# Altium schematic sheet Gigabit Ethernet.SchDoc
size 594 x 420 mm
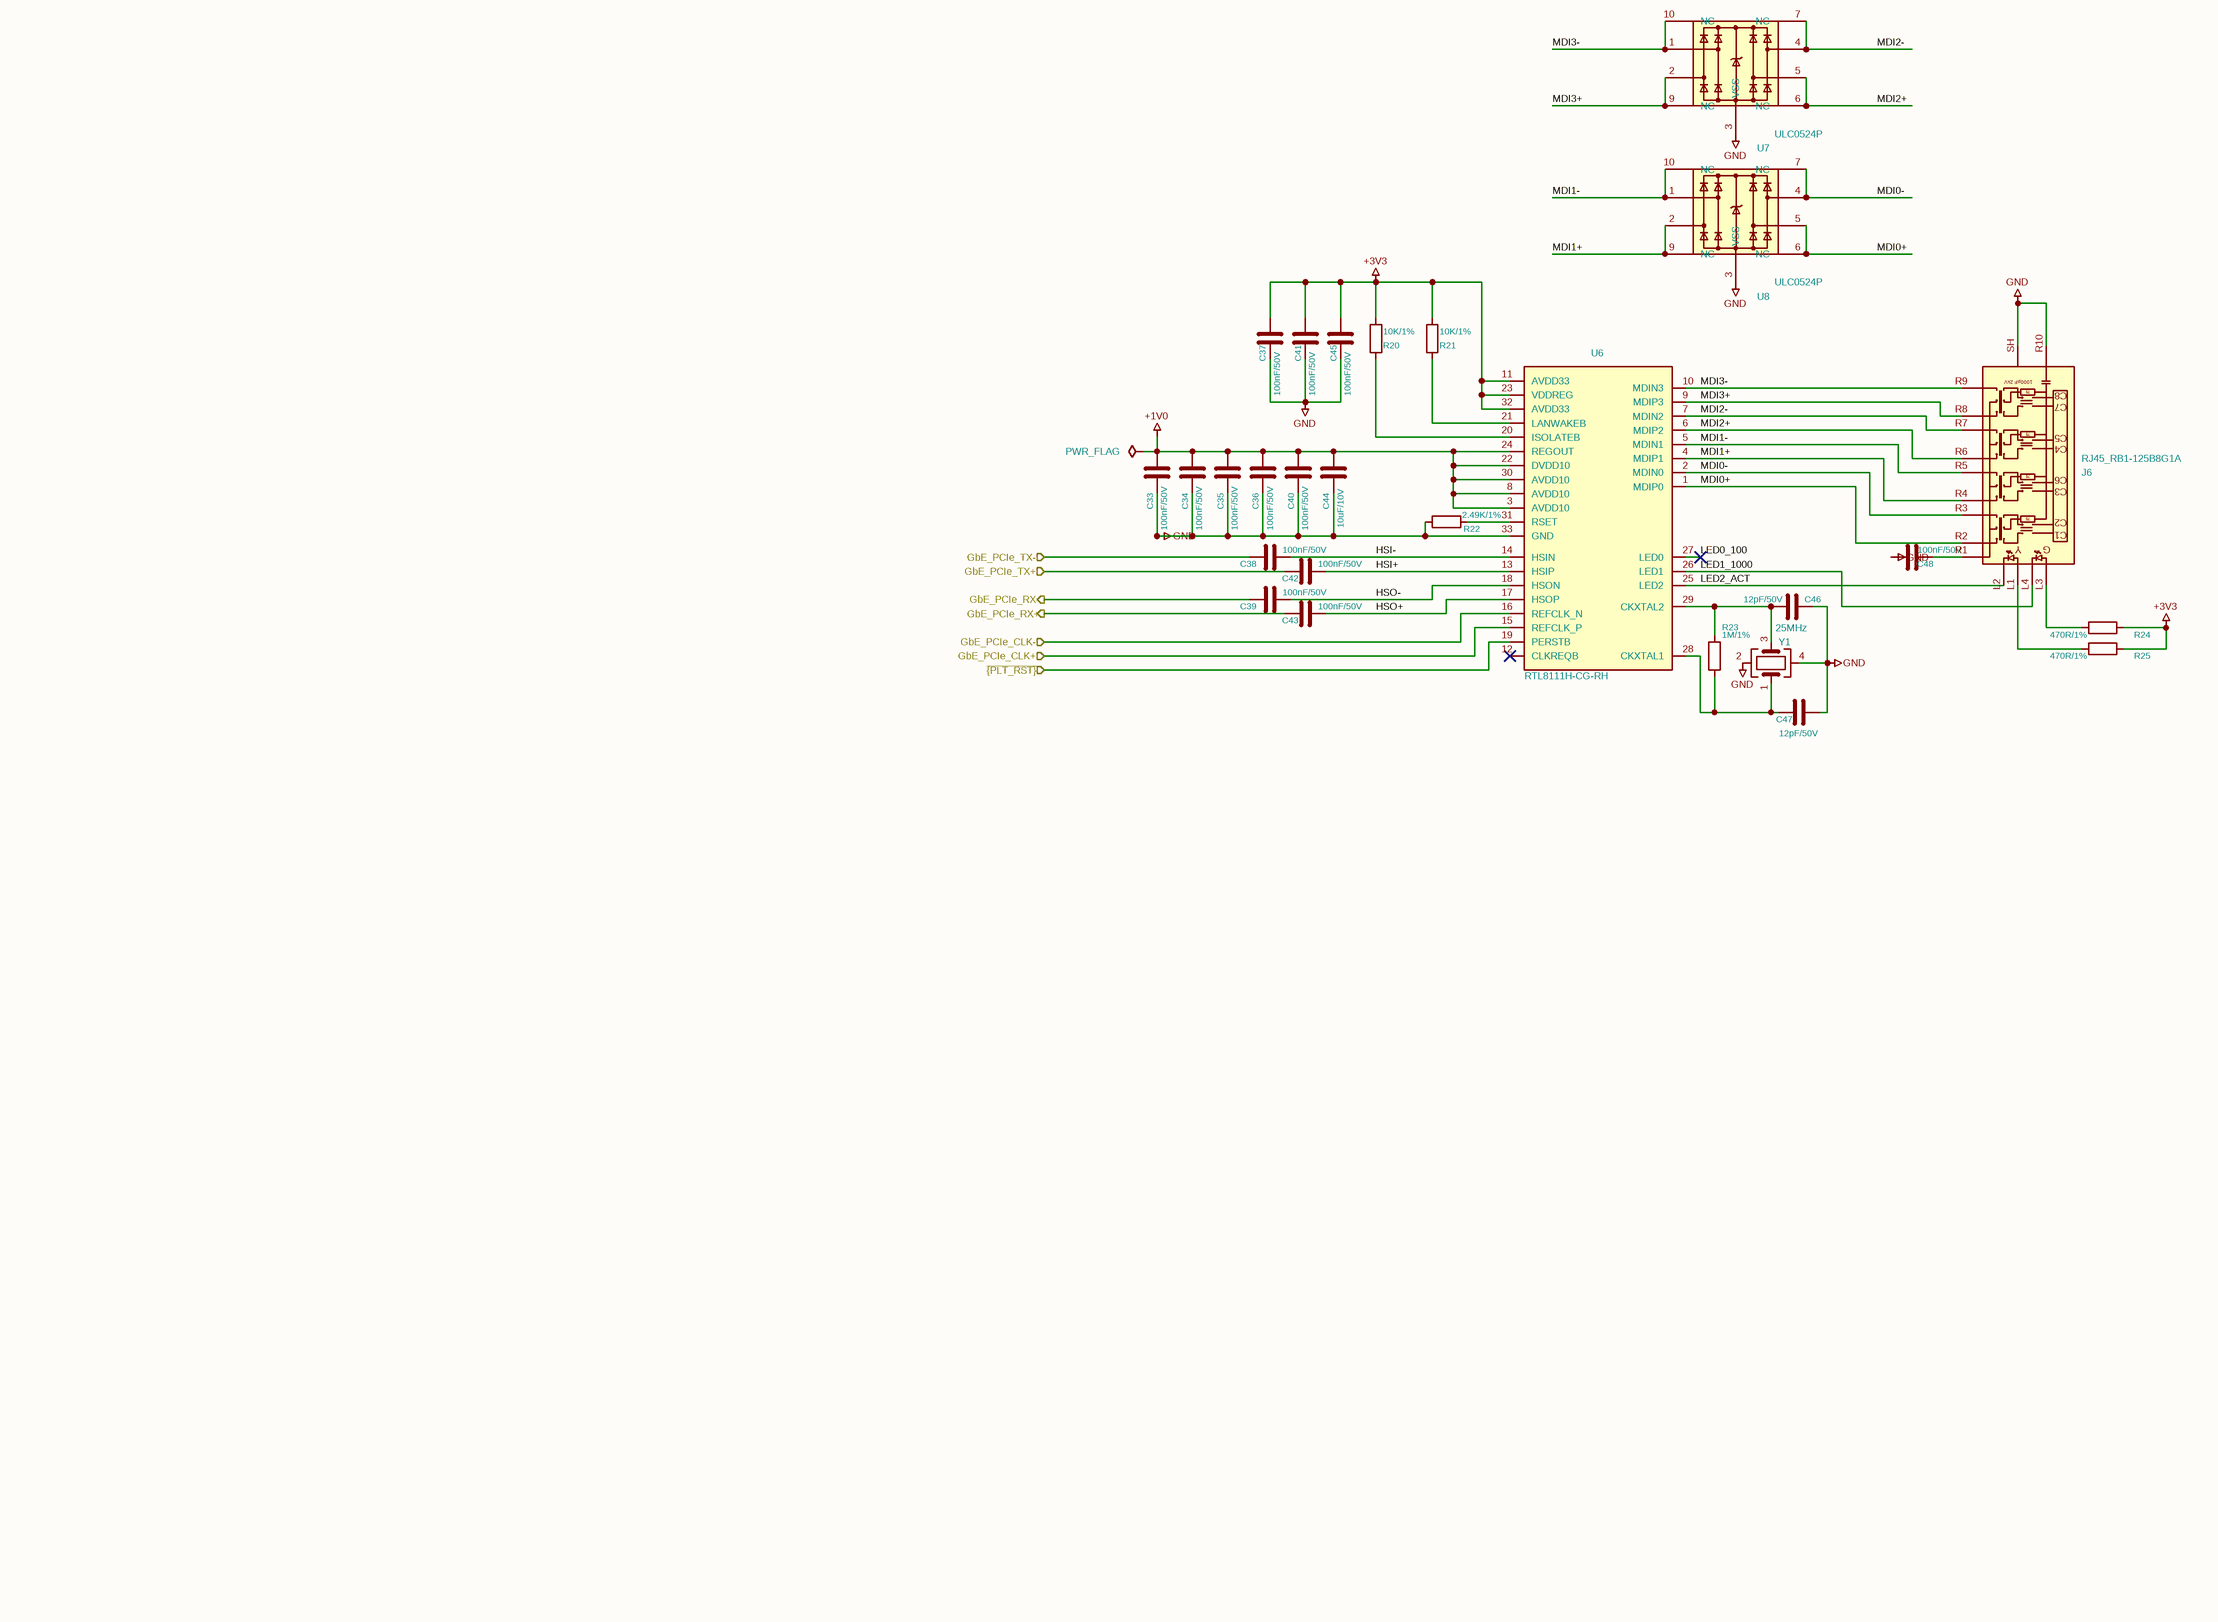
[diagram p0: Gigabit Ethernet.SchDoc]

## Parts
#FLG0601  PWR_FLAG  (graphical)
C33  100nF/50V  [C_0402_1005Metric]
C34  100nF/50V  [C_0402_1005Metric]
C35  100nF/50V  [C_0402_1005Metric]
C36  100nF/50V  [C_0402_1005Metric]
C37  100nF/50V  [C_0402_1005Metric]
C38  100nF/50V  [C_0402_1005Metric]
C39  100nF/50V  [C_0402_1005Metric]
C40  100nF/50V  [C_0402_1005Metric]
C41  100nF/50V  [C_0402_1005Metric]
C42  100nF/50V  [C_0402_1005Metric]
C43  100nF/50V  [C_0402_1005Metric]
C44  10uF/10V  [C_0402_1005Metric]
C45  100nF/50V  [C_0402_1005Metric]
C46  12pF/50V  [C_0402_1005Metric]
C47  12pF/50V  [C_0402_1005Metric]
C48  100nF/50V  [C_0402_1005Metric]
J6  RJ45_RB1-125B8G1A  [RJ45_UDE_RB1-125B8G1A]
R20  10K/1%  [R_0402_1005Metric]
R21  10K/1%  [R_0402_1005Metric]
R22  2.49K/1%  [R_0603_1608Metric]
R23  1M/1%  [R_0402_1005Metric]
R24  470R/1%  [R_0402_1005Metric]
R25  470R/1%  [R_0402_1005Metric]
U6  RTL8111H-CG-RH  [QFN-32-1EP_4x4mm_P0.4mm_EP2.65x2.65mm]
U7  ULC0524P  [Diodes_UDFN-10_1.0x2.5mm_P0.5mm]
U8  ULC0524P  [Diodes_UDFN-10_1.0x2.5mm_P0.5mm]
Y1  25MHz  [Crystal_SMD_3225-4Pin_3.2x2.5mm]

## Ports
GbE_PCIe_CLK+ (in), GbE_PCIe_CLK- (in), GbE_PCIe_RX+ (out), GbE_PCIe_RX- (out), GbE_PCIe_TX+ (in), GbE_PCIe_TX- (in), ~{{PLT_RST}} (in)

## Nets
+1V0: #FLG0601.1 C33.2 C34.2 C35.2 C36.2 C40.2 C44.2 U6.3(AVDD10) U6.8(AVDD10) U6.22(DVDD10) U6.24(REGOUT) U6.30(AVDD10)
+3V3: C37.2 C41.2 C45.2 R20.1 R21.1 R24.2 R25.2 U6.11(AVDD33) U6.23(VDDREG) U6.32(AVDD33)
GND: C33.1 C34.1 C35.1 C36.1 C37.1 C40.1 C41.1 C44.1 C45.1 C46.1 C47.1 C48.2 J6.R10(GND) J6.SH R22.1 U6.33(GND) U7.3(VSS) U8.3(VSS) Y1.2 Y1.4
GbE_PCIe_CLK+: U6.15(REFCLK_P) ; port GbE_PCIe_CLK+
GbE_PCIe_CLK-: U6.16(REFCLK_N) ; port GbE_PCIe_CLK-
GbE_PCIe_RX+: C43.2 ; port GbE_PCIe_RX+
GbE_PCIe_RX-: C39.2 ; port GbE_PCIe_RX-
GbE_PCIe_TX+: C42.2 ; port GbE_PCIe_TX+
GbE_PCIe_TX-: C38.2 ; port GbE_PCIe_TX-
HSI+: C42.1 U6.13(HSIP)
HSI-: C38.1 U6.14(HSIN)
HSO+: C43.1 U6.17(HSOP)
HSO-: C39.1 U6.18(HSON)
LED0_100: U6.27(LED0)
LED1_1000: J6.L4 U6.26(LED1)
LED2_ACT: J6.L2 U6.25(LED2)
MDI0+: J6.R2(TD1+) U6.1(MDIP0) U8.5 U8.6(NC)
MDI0-: J6.R3(TD1-) U6.2(MDIN0) U8.4 U8.7(NC)
MDI1+: J6.R4(TD2+) U6.4(MDIP1) U8.2 U8.9(NC)
MDI1-: J6.R5(TD2-) U6.5(MDIN1) U8.1 U8.10(NC)
MDI2+: J6.R6(TD3+) U6.6(MDIP2) U7.5 U7.6(NC)
MDI2-: J6.R7(TD3-) U6.7(MDIN2) U7.4 U7.7(NC)
MDI3+: J6.R8(TD4+) U6.9(MDIP3) U7.2 U7.9(NC)
MDI3-: J6.R9(TD4-) U6.10(MDIN3) U7.1 U7.10(NC)
~{{PLT_RST}}: U6.19(PERSTB) ; port ~{{PLT_RST}}
NetC46_2: C46.2 R23.1 U6.29(CKXTAL2) Y1.3
NetC47_2: C47.2 R23.2 U6.28(CKXTAL1) Y1.1
NetC48_1: C48.1 J6.R1(CT)
NetJ6_L1: J6.L1 R25.1
NetJ6_L3: J6.L3 R24.1
NetR20_2: R20.2 U6.20(ISOLATEB)
NetR21_2: R21.2 U6.21(LANWAKEB)
NetR22_2: R22.2 U6.31(RSET)

Not connected (* = marked no-connect by the designer): U6 12(CLKREQB)*; U7 8(VSS); U8 8(VSS)

## Notes on the sheet
- 1
- 2
- 3
- 4
- 5
- 6
- 7
- 8
- 9
- 10
- 11
- A
- B
- C
- D
- E
- F
- G
- H
- Title: Primer Carrier for LattePanda Mu
- File: Gigabit Ethernet.kicad_sch
- Sheet: /
- DFRobot
- KiCad E.D.A.  kicad (5.1.4)-1
- Size: A2
- Date: 2024-03-13
- Rev: V1.0.0
- Id: 1/1
- (in symbol RJ45_RB1-125B8G1A) 1000pF 2kV; 75; C8; C7; C5; C4; C6; C3; C2; C1; Y; G

## Library data of the parts
C33-C48 = C: SCH_Show_Footprint: C0402; Footprint: A_HDJ_Library:C_0402_1005Metric
  C33-C43 C45 C48: Value: 100nF/50V
  C44: Value: 10uF/10V
  C46 C47: Value: 12pF/50V
R20-R25 = R
  R20 R21: Value: 10K/1%; Footprint: A_HDJ_Library:R_0402_1005Metric
  R22: Value: 2.49K/1%; Footprint: A_HDJ_Library:R_0603_1608Metric
  R23: Value: 1M/1%; Footprint: A_HDJ_Library:R_0402_1005Metric
  R24 R25: Value: 470R/1%; Footprint: A_HDJ_Library:R_0402_1005Metric
U7 U8 = D3V3XA4B10LP: Value: ULC0524P; Footprint: Package_DFN_QFN:Diodes_UDFN-10_1.0x2.5mm_P0.5mm
Y1 = Crystal_GND24: Value: 25MHz; Footprint: A_HDJ_Library:Crystal_SMD_3225-4Pin_3.2x2.5mm
#FLG0601 = PWR_FLAG: Value: PWR_FLAG
J6 = RJ45_RB1-125B8G1A: Value: RJ45_RB1-125B8G1A; Footprint: A_HDJ_Library:RJ45_UDE_RB1-125B8G1A
U6 = RTL8111H-CG-RH: Value: RTL8111H-CG-RH; Footprint: A_HDJ_Library:QFN-32-1EP_4x4mm_P0.4mm_EP2.65x2.65mm